# Altium schematic sheet Power and can.SchDoc
size A4
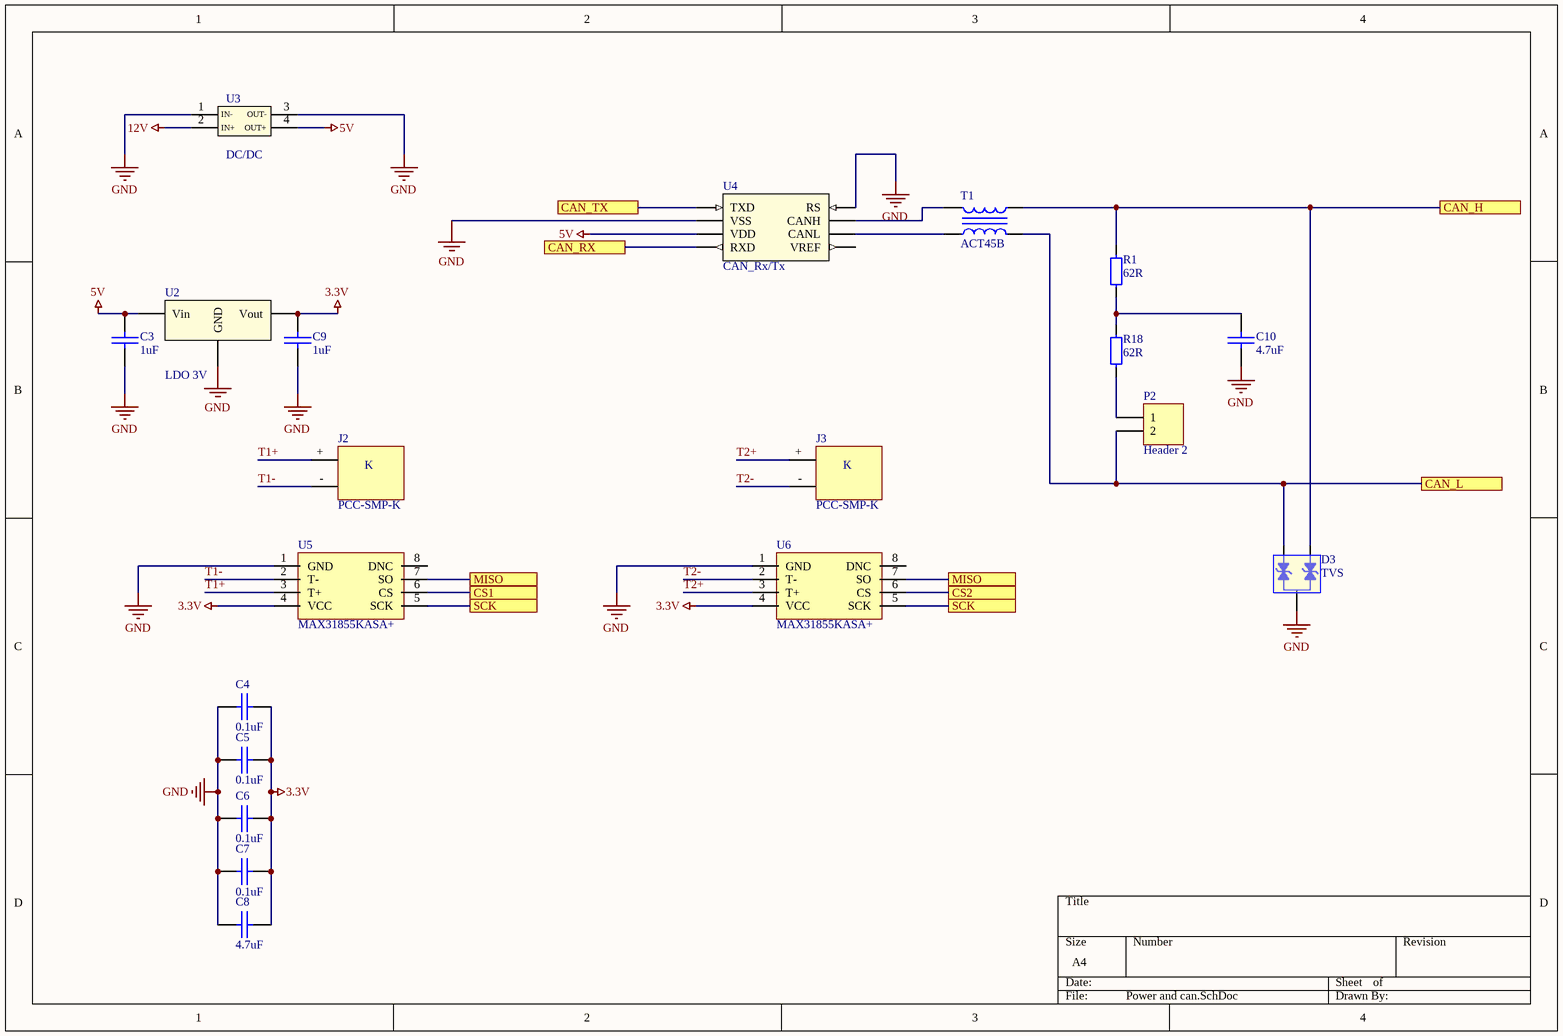
[diagram p0: Power and can.SchDoc]

## Parts
C3  1uF  [0805 Capicator]
C4  0.1uF  [0805 Capicator]
C5  0.1uF  [0805 Capicator]
C6  0.1uF  [0805 Capicator]
C7  0.1uF  [0805 Capicator]
C8  4.7uF  [0805 Capicator]
C9  1uF  [0805 Capicator]
C10  4.7uF  [0805 Capicator]
D3  TVS  [SOT-23]
J2  PCC-SMP-K  [thermocouple]
J3  PCC-SMP-K  [thermocouple]
P2  Header 2  [HDR1X2]
R1  62R  [0805 Resistor]
R18  62R  [0805 Resistor]
T1  ACT45B  [ACT45B]
U2  LDO 3V  [SOT-23]
U3  DC/DC  [DC-DC]
U4  CAN_Rx/Tx  [SO-8]
U5  MAX31855KASA+  [SO-8]
U6  MAX31855KASA+  [SO-8]

## Ports
CAN_H, CAN_L, CAN_RX, CAN_TX, CS1, CS2, MISO, SCK

## Nets
3.3V: C4.1 C5.1 C6.1 C7.1 C8.2 C9.1 U2.2(Vout) U5.4(VCC) U6.4(VCC)
5V: C3.2 U2.3(Vin) U3.4(OUT+) U4.3(VDD)
12V: U3.2(IN+)
GND: C3.1 C4.2 C5.2 C6.2 C7.2 C8.1 C9.2 C10.1 D3.3 U2.1(GND) U3.1(IN-) U3.3(OUT-) U4.2(VSS) U4.8(RS) U5.1(GND) U6.1(GND)
CAN_H: D3.1 R1.2 T1.4 ; port CAN_H
CAN_L: D3.2 P2.2 T1.3 ; port CAN_L
CAN_RX: U4.4(RXD) ; port CAN_RX
CAN_TX: U4.1(TXD) ; port CAN_TX
CS1: U5.6(CS) ; port CS1
CS2: U6.6(CS) ; port CS2
MISO: U5.7(SO) U6.7(SO) ; port MISO
SCK: U5.5(SCK) U6.5(SCK) ; port SCK
T1+: J2.+ U5.3(T+)
T1-: J2.- U5.2(T-)
T2+: J3.+ U6.3(T+)
T2-: J3.- U6.2(T-)
NetC10_2: C10.2 R1.1 R18.2
NetP2_1: P2.1 R18.1
NetT1_1: T1.1 U4.7(CANH)
NetT1_2: T1.2 U4.6(CANL)

Not connected (* = marked no-connect by the designer): U4 5(VREF); U5 8(DNC); U6 8(DNC)

## Notes on the sheet
- (in symbol thermocoupleconnector) K

## Library data of the parts
C3 C9 = Cap 1uF (0805): 1uF X7R 10% 16V 0805; Manufacturer: Murata Manufacturing; Part Number: GRM21BR71C105KA01K; Type: Capacitor; ComponentLink1Description: Chip&Dip; ComponentLink1URL: https://www.chipdip.ru/product/grm21br71c105k
C4-C7 = Cap 0.1uF (0805): 0.1uF X7R 50V 10% 0805; Manufacturer: Murata Manufacturing; Part Number: GRM21BR71H104K; Type: Capacitor; ComponentLink1Description: Chip&Dip; ComponentLink1URL: https://www.chipdip.ru/product/grm21br71h104k
C8 C10 = Cap 4.7uF (0805): 4.7uF X5R 10% 25V 0805; Manufacturer: Murata Manufacturing; Part Number: GRM21BR61E475KA12L; Type: Capacitor; ComponentLink1Description: Chip&Dip; ComponentLink1URL: https://www.chipdip.ru/product/grm21br61e475ka12l
D3 = TVS Diode Arrays: Part Number: SM24CANB-02HTG; Manufacturer: Littelfuse; Type: Diode; ComponentLink1Description: DataSheet; ComponentLink1URL: https://m.littelfuse.com/~/media/electronics/datasheets/tvs_diode_arrays/littelfuse_tvs_diode_array_sm24canb_datasheet.pdf.pdf; ComponentLink2Description: Chip&Dip; ComponentLink2URL: https://www.chipdip.ru/product1/8001779022
J2 J3 = thermocoupleconnector
P2 = Header 2: Header, 2-Pin; LatestRevisionDate: 17-Jul-2002; LatestRevisionNote: Re-released for DXP Platform.; Publisher: Altium Limited
R1 R18 = Res 62R (0805): 0.125W 0805 62R, 1%; Part Number: RC0805FR-0762RL; Manufacturer: Taiwan; Type: Resistor; ComponentLink1Description: Chip&Dip; ComponentLink1URL: https://www.chipdip.ru/product0/9000079457
T1 = ACT45B: Common mode filters / Automotive signal line (for power train/safety); Manufacturer: EMC Components; Part Number: ACT45B-510-2P-TL003; Type: Inductor; ComponentLink1Description: DataSheet; ComponentLink1URL: https://product.tdk.com/info/en/catalog/datasheets/cmf_automotive_signal_act45b_en.pdf
U2 = LDO 3V [MCP]: MCP1702 Low Dropout Voltage Regulator. The input operating range is specifiedfrom 2.7V to 13.2V; Part Number: MCP1702T-3002E/CB; Manufacturer: Microchip; ComponentLink1Description: DataSheet; ComponentLink1URL: https://static.chipdip.ru/lib/986/DOC003986671.pdf; ComponentLink2Description: Chip&Dip; ComponentLink2URL: https://www.chipdip.ru/product/mcp1702t-3002e-cb-microchip
U3 = DC/DC: DC/DC 5V with MP2307 Chip
U4 = CAN Transceiver [MCP2551]: High-speed  CAN,  fault-tolerantdevice  that  serves  as  the  interface  between  a  CANprotocol controller and the physical bus.; Part Number: MCP2551-I/SN; Manufacturer: Microchip; ComponentLink1Description: DataSheet; ComponentLink1URL: https://static.chipdip.ru/lib/204/DOC000204457.pdf; ComponentLink2Description: Chip&Dip; ComponentLink2URL: https://www.chipdip.ru/product/mcp2551-i-sn; Type: IC
U5 U6 = MAX31855KASA+: ComponentLink1Description: CHIP&DIP; ComponentLink1URL: https://www.chipdip.ru/product/max31855kasa; ComponentLink2Description: Datasheet; ComponentLink2URL: https://static.chipdip.ru/lib/121/DOC001121138.pdf